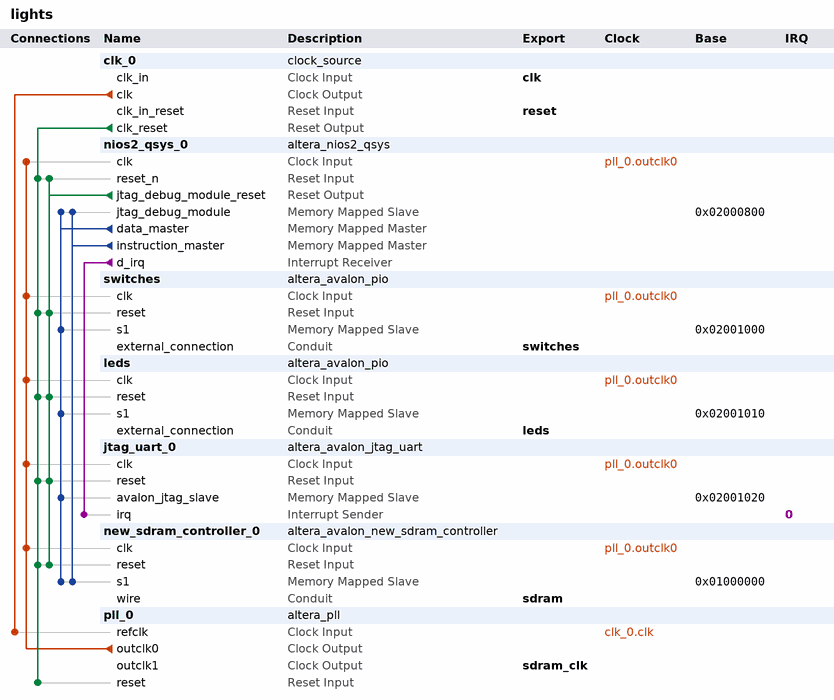
[diagram p0: system contents]
# Platform Designer (Qsys) system lights, Cyclone V 5CSEMA5F31C6
# Parameters at their usual value, and those the tool derives, are not listed.
package require -exact qsys 18.1
create_system lights
set_project_property DEVICE_FAMILY {Cyclone V}
set_project_property DEVICE 5CSEMA5F31C6

add_instance clk_0 clock_source 18.1
set_instance_parameter_value clk_0 clockFrequency 50000000

add_instance nios2_qsys_0 altera_nios2_qsys 16.1
set_instance_parameter_value nios2_qsys_0 breakSlave nios2_qsys_0.jtag_debug_module
set_instance_parameter_value nios2_qsys_0 exceptionSlave new_sdram_controller_0.s1
set_instance_parameter_value nios2_qsys_0 icache_size 4096
set_instance_parameter_value nios2_qsys_0 impl Tiny
set_instance_parameter_value nios2_qsys_0 mmu_TLBMissExcSlave None
set_instance_parameter_value nios2_qsys_0 resetSlave new_sdram_controller_0.s1
set_instance_parameter_value nios2_qsys_0 resetrequest_enabled true

add_instance switches altera_avalon_pio 18.1
set_instance_parameter_value switches direction Input
set_instance_parameter_value switches width 4

add_instance leds altera_avalon_pio 18.1
set_instance_parameter_value leds direction Output
set_instance_parameter_value leds width 4

add_instance jtag_uart_0 altera_avalon_jtag_uart 18.1
set_instance_parameter_value jtag_uart_0 simInteractiveOptions NO_INTERACTIVE_WINDOWS

add_instance new_sdram_controller_0 altera_avalon_new_sdram_controller 18.1
set_instance_parameter_value new_sdram_controller_0 TAC 5.5
set_instance_parameter_value new_sdram_controller_0 TRCD 20.0
set_instance_parameter_value new_sdram_controller_0 TRP 20.0
set_instance_parameter_value new_sdram_controller_0 casLatency 3
set_instance_parameter_value new_sdram_controller_0 columnWidth 8
set_instance_parameter_value new_sdram_controller_0 dataWidth 32
set_instance_parameter_value new_sdram_controller_0 generateSimulationModel false
set_instance_parameter_value new_sdram_controller_0 model single_Micron_MT48LC4M32B2_7_chip
set_instance_parameter_value new_sdram_controller_0 numberOfBanks 4
set_instance_parameter_value new_sdram_controller_0 numberOfChipSelects 1
set_instance_parameter_value new_sdram_controller_0 powerUpDelay 100.0
set_instance_parameter_value new_sdram_controller_0 refreshPeriod 15.625
set_instance_parameter_value new_sdram_controller_0 rowWidth 12

add_instance pll_0 altera_pll 18.1
set_instance_parameter_value pll_0 gui_device_speed_grade 1
set_instance_parameter_value pll_0 gui_number_of_clocks 2
set_instance_parameter_value pll_0 gui_operation_mode direct
set_instance_parameter_value pll_0 gui_output_clock_frequency0 143.0
set_instance_parameter_value pll_0 gui_output_clock_frequency1 100.0
set_instance_parameter_value pll_0 gui_pll_mode {Integer-N PLL}
set_instance_parameter_value pll_0 gui_reference_clock_frequency 50.0
set_instance_parameter_value pll_0 gui_use_locked true

# connections
add_connection clk_0.clk pll_0.refclk clock
add_connection pll_0.outclk0 jtag_uart_0.clk clock
add_connection pll_0.outclk0 leds.clk clock
add_connection pll_0.outclk0 new_sdram_controller_0.clk clock
add_connection pll_0.outclk0 nios2_qsys_0.clk clock
add_connection pll_0.outclk0 switches.clk clock
add_connection clk_0.clk_reset jtag_uart_0.reset reset
add_connection clk_0.clk_reset leds.reset reset
add_connection clk_0.clk_reset new_sdram_controller_0.reset reset
add_connection clk_0.clk_reset nios2_qsys_0.reset_n reset
add_connection clk_0.clk_reset pll_0.reset reset
add_connection clk_0.clk_reset switches.reset reset
add_connection nios2_qsys_0.jtag_debug_module_reset jtag_uart_0.reset reset
add_connection nios2_qsys_0.jtag_debug_module_reset leds.reset reset
add_connection nios2_qsys_0.jtag_debug_module_reset new_sdram_controller_0.reset reset
add_connection nios2_qsys_0.jtag_debug_module_reset nios2_qsys_0.reset_n reset
add_connection nios2_qsys_0.jtag_debug_module_reset switches.reset reset
add_connection nios2_qsys_0.data_master jtag_uart_0.avalon_jtag_slave avalon
set_connection_parameter_value nios2_qsys_0.data_master/jtag_uart_0.avalon_jtag_slave baseAddress 0x02001020
add_connection nios2_qsys_0.data_master leds.s1 avalon
set_connection_parameter_value nios2_qsys_0.data_master/leds.s1 baseAddress 0x02001010
add_connection nios2_qsys_0.data_master new_sdram_controller_0.s1 avalon
set_connection_parameter_value nios2_qsys_0.data_master/new_sdram_controller_0.s1 baseAddress 0x01000000
add_connection nios2_qsys_0.data_master nios2_qsys_0.jtag_debug_module avalon
set_connection_parameter_value nios2_qsys_0.data_master/nios2_qsys_0.jtag_debug_module baseAddress 0x02000800
add_connection nios2_qsys_0.data_master switches.s1 avalon
set_connection_parameter_value nios2_qsys_0.data_master/switches.s1 baseAddress 0x02001000
add_connection nios2_qsys_0.instruction_master new_sdram_controller_0.s1 avalon
set_connection_parameter_value nios2_qsys_0.instruction_master/new_sdram_controller_0.s1 baseAddress 0x01000000
add_connection nios2_qsys_0.instruction_master nios2_qsys_0.jtag_debug_module avalon
set_connection_parameter_value nios2_qsys_0.instruction_master/nios2_qsys_0.jtag_debug_module baseAddress 0x02000800
add_connection nios2_qsys_0.d_irq jtag_uart_0.irq interrupt
set_connection_parameter_value nios2_qsys_0.d_irq/jtag_uart_0.irq irqNumber 0

# exported interfaces
add_interface clk clock sink
set_interface_property clk EXPORT_OF clk_0.clk_in
add_interface leds conduit end
set_interface_property leds EXPORT_OF leds.external_connection
add_interface reset reset sink
set_interface_property reset EXPORT_OF clk_0.clk_in_reset
add_interface sdram conduit end
set_interface_property sdram EXPORT_OF new_sdram_controller_0.wire
add_interface sdram_clk clock source
set_interface_property sdram_clk EXPORT_OF pll_0.outclk1
add_interface switches conduit end
set_interface_property switches EXPORT_OF switches.external_connection

set_interconnect_requirement {$system} qsys_mm.clockCrossingAdapter HANDSHAKE
set_interconnect_requirement {$system} qsys_mm.enableEccProtection FALSE
set_interconnect_requirement {$system} qsys_mm.insertDefaultSlave FALSE
set_interconnect_requirement {$system} qsys_mm.maxAdditionalLatency 1

save_system lights.qsys
